# Altium schematic sheet low-pass-filters.SchDoc
size A3
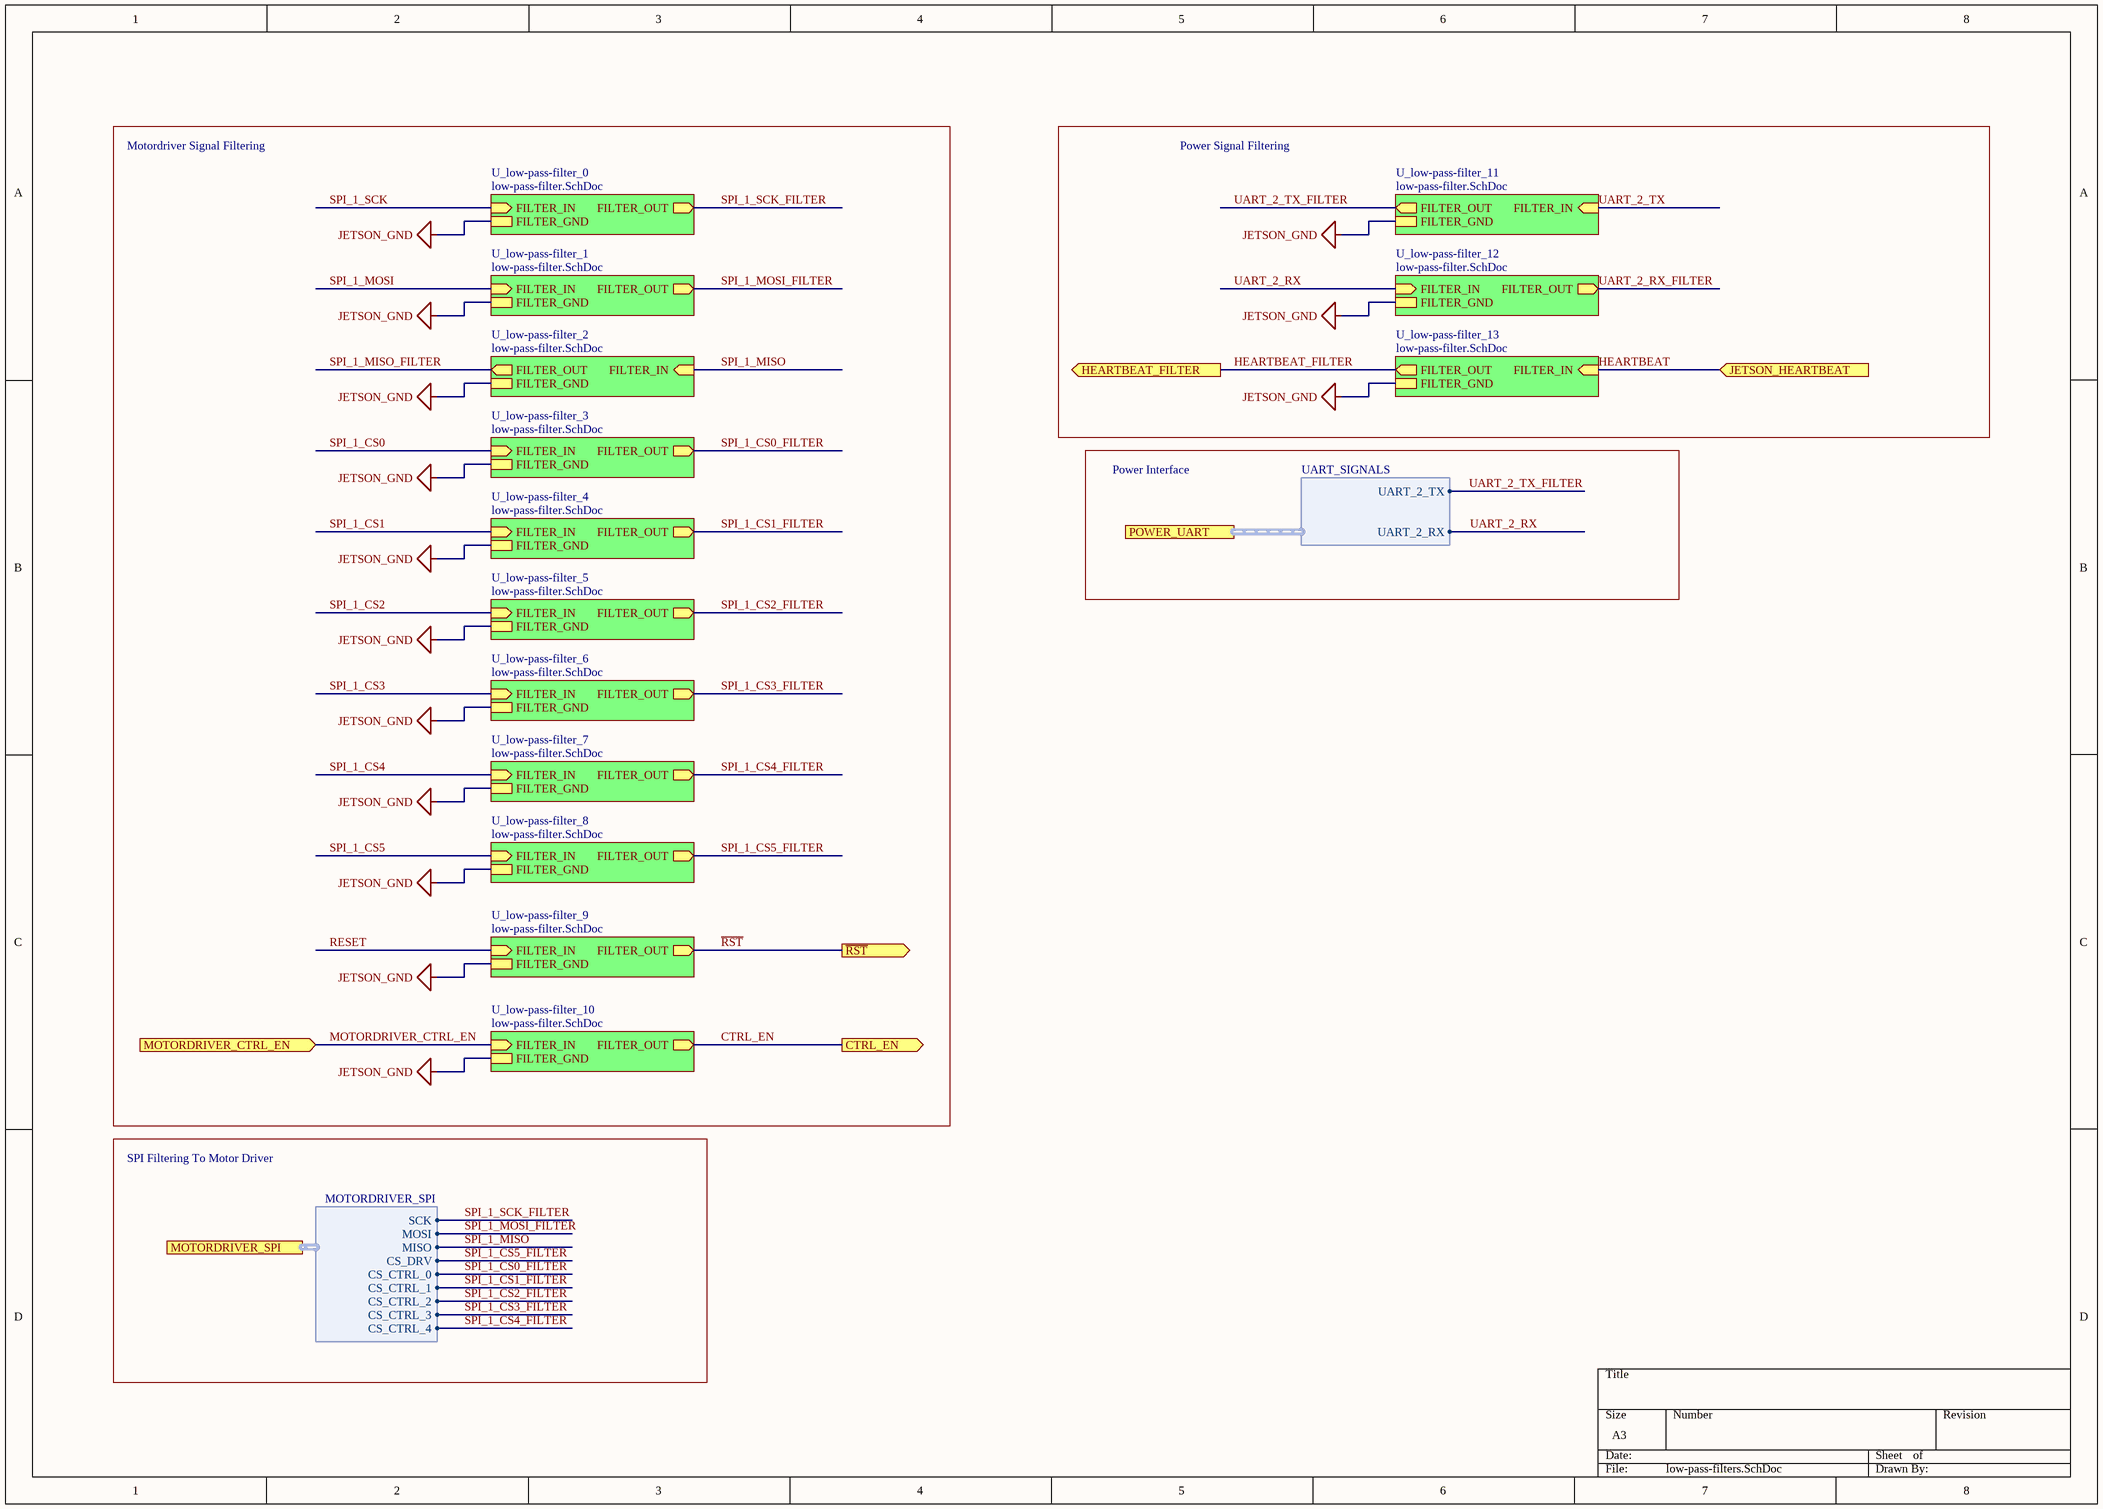
[diagram p0: low-pass-filters.SchDoc]

## Sub-sheets
U_low-pass-filter_0 = low-pass-filter.SchDoc: FILTER_OUT (out), FILTER_IN (in), FILTER_GND
U_low-pass-filter_1 = low-pass-filter.SchDoc: FILTER_OUT (out), FILTER_IN (in), FILTER_GND
U_low-pass-filter_2 = low-pass-filter.SchDoc: FILTER_IN (in), FILTER_OUT (out), FILTER_GND
U_low-pass-filter_3 = low-pass-filter.SchDoc: FILTER_OUT (out), FILTER_IN (in), FILTER_GND
U_low-pass-filter_4 = low-pass-filter.SchDoc: FILTER_OUT (out), FILTER_IN (in), FILTER_GND
U_low-pass-filter_5 = low-pass-filter.SchDoc: FILTER_OUT (out), FILTER_IN (in), FILTER_GND
U_low-pass-filter_6 = low-pass-filter.SchDoc: FILTER_OUT (out), FILTER_IN (in), FILTER_GND
U_low-pass-filter_7 = low-pass-filter.SchDoc: FILTER_OUT (out), FILTER_IN (in), FILTER_GND
U_low-pass-filter_8 = low-pass-filter.SchDoc: FILTER_OUT (out), FILTER_IN (in), FILTER_GND
U_low-pass-filter_9 = low-pass-filter.SchDoc: FILTER_OUT (out), FILTER_IN (in), FILTER_GND
U_low-pass-filter_10 = low-pass-filter.SchDoc: FILTER_OUT (out), FILTER_IN (in), FILTER_GND
U_low-pass-filter_11 = low-pass-filter.SchDoc: FILTER_OUT (out), FILTER_IN (in), FILTER_GND
U_low-pass-filter_12 = low-pass-filter.SchDoc: FILTER_OUT (out), FILTER_IN (in), FILTER_GND
U_low-pass-filter_13 = low-pass-filter.SchDoc: FILTER_IN (in), FILTER_OUT (out), FILTER_GND

## Ports
CTRL_EN (out), HEARTBEAT_FILTER (out), JETSON_HEARTBEAT (in), MOTORDRIVER_CTRL_EN (in), MOTORDRIVER_SPI (harness MOTORDRIVER_SPI), POWER_UART (harness UART_SIGNALS), ~{RST} (out)

## Harnesses
MOTORDRIVER_SPI: CS_CTRL_0, CS_DRV, SCK, MOSI, MISO, CS_CTRL_1, CS_CTRL_2, CS_CTRL_3, CS_CTRL_4
UART_SIGNALS: UART_2_RX, UART_2_TX

## Nets
JETSON_GND: sheet U_low-pass-filter_11/FILTER_GND, sheet U_low-pass-filter_12/FILTER_GND, sheet U_low-pass-filter_13/FILTER_GND, sheet U_low-pass-filter_8/FILTER_GND, sheet U_low-pass-filter_0/FILTER_GND, sheet U_low-pass-filter_1/FILTER_GND, sheet U_low-pass-filter_2/FILTER_GND, sheet U_low-pass-filter_3/FILTER_GND, sheet U_low-pass-filter_4/FILTER_GND, sheet U_low-pass-filter_5/FILTER_GND, sheet U_low-pass-filter_6/FILTER_GND, sheet U_low-pass-filter_7/FILTER_GND, sheet U_low-pass-filter_9/FILTER_GND, sheet U_low-pass-filter_10/FILTER_GND
CTRL_EN: port CTRL_EN, sheet U_low-pass-filter_10/FILTER_OUT
HEARTBEAT: port JETSON_HEARTBEAT, sheet U_low-pass-filter_13/FILTER_IN
HEARTBEAT_FILTER: port HEARTBEAT_FILTER, sheet U_low-pass-filter_13/FILTER_OUT
MOTORDRIVER_CTRL_EN: port MOTORDRIVER_CTRL_EN, sheet U_low-pass-filter_10/FILTER_IN
~{RST}: port ~{RST}, sheet U_low-pass-filter_9/FILTER_OUT
RESET: sheet U_low-pass-filter_9/FILTER_IN
SPI_1_CS0: sheet U_low-pass-filter_3/FILTER_IN
SPI_1_CS0_FILTER: sheet U_low-pass-filter_3/FILTER_OUT, port MOTORDRIVER_SPI.CS_CTRL_0
SPI_1_CS1: sheet U_low-pass-filter_4/FILTER_IN
SPI_1_CS1_FILTER: sheet U_low-pass-filter_4/FILTER_OUT, port MOTORDRIVER_SPI.CS_CTRL_1
SPI_1_CS2: sheet U_low-pass-filter_5/FILTER_IN
SPI_1_CS2_FILTER: sheet U_low-pass-filter_5/FILTER_OUT, port MOTORDRIVER_SPI.CS_CTRL_2
SPI_1_CS3: sheet U_low-pass-filter_6/FILTER_IN
SPI_1_CS3_FILTER: sheet U_low-pass-filter_6/FILTER_OUT, port MOTORDRIVER_SPI.CS_CTRL_3
SPI_1_CS4: sheet U_low-pass-filter_7/FILTER_IN
SPI_1_CS4_FILTER: sheet U_low-pass-filter_7/FILTER_OUT, port MOTORDRIVER_SPI.CS_CTRL_4
SPI_1_CS5: sheet U_low-pass-filter_8/FILTER_IN
SPI_1_CS5_FILTER: sheet U_low-pass-filter_8/FILTER_OUT, port MOTORDRIVER_SPI.CS_DRV
SPI_1_MISO: sheet U_low-pass-filter_2/FILTER_IN, port MOTORDRIVER_SPI.MISO
SPI_1_MISO_FILTER: sheet U_low-pass-filter_2/FILTER_OUT
SPI_1_MOSI: sheet U_low-pass-filter_1/FILTER_IN
SPI_1_MOSI_FILTER: sheet U_low-pass-filter_1/FILTER_OUT, port MOTORDRIVER_SPI.MOSI
SPI_1_SCK: sheet U_low-pass-filter_0/FILTER_IN
SPI_1_SCK_FILTER: sheet U_low-pass-filter_0/FILTER_OUT, port MOTORDRIVER_SPI.SCK
UART_2_RX: sheet U_low-pass-filter_12/FILTER_IN, port POWER_UART.UART_2_RX
UART_2_RX_FILTER: sheet U_low-pass-filter_12/FILTER_OUT
UART_2_TX: sheet U_low-pass-filter_11/FILTER_IN
UART_2_TX_FILTER: sheet U_low-pass-filter_11/FILTER_OUT, port POWER_UART.UART_2_TX

## Notes on the sheet
- Motordriver Signal Filtering
- Power Signal Filtering
- Power Interface
- SPI Filtering To Motor Driver